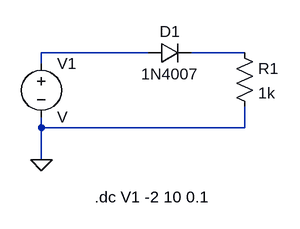
[diagram p0: schematic TP2 punto 1 sim.asc]
TP2 punto 1 sim.asc, the LTspice schematic file:
Version 4
SHEET 1 880 680
WIRE 128 -224 -32 -224
WIRE 272 -224 192 -224
WIRE -32 -208 -32 -224
WIRE -32 -112 -32 -128
WIRE 272 -112 272 -144
WIRE 272 -112 -32 -112
WIRE -32 -64 -32 -112
FLAG -32 -64 0
SYMBOL diode 128 -208 R270
WINDOW 0 32 32 VTop 2
WINDOW 3 0 32 VBottom 2
SYMATTR InstName D1
SYMATTR Value 1N4007
SYMBOL res 256 -240 R0
SYMATTR InstName R1
SYMATTR Value 1k
SYMBOL voltage -32 -224 R0
SYMATTR InstName V1
TEXT 48 -8 Left 2 !.dc V1 -2 10 0.1

The netlist it stands for:
* TP2 punto 1 sim.asc
D1 N001 N002 1N4007
R1 N002 0 1k
V1 N001 0 V
.model D D
.lib standard.dio
.dc V1 -2 10 0.1
.backanno
.end